# EAGLE schematic Sound_Activated_LED_Schematic (EAGLE 9.7.0)
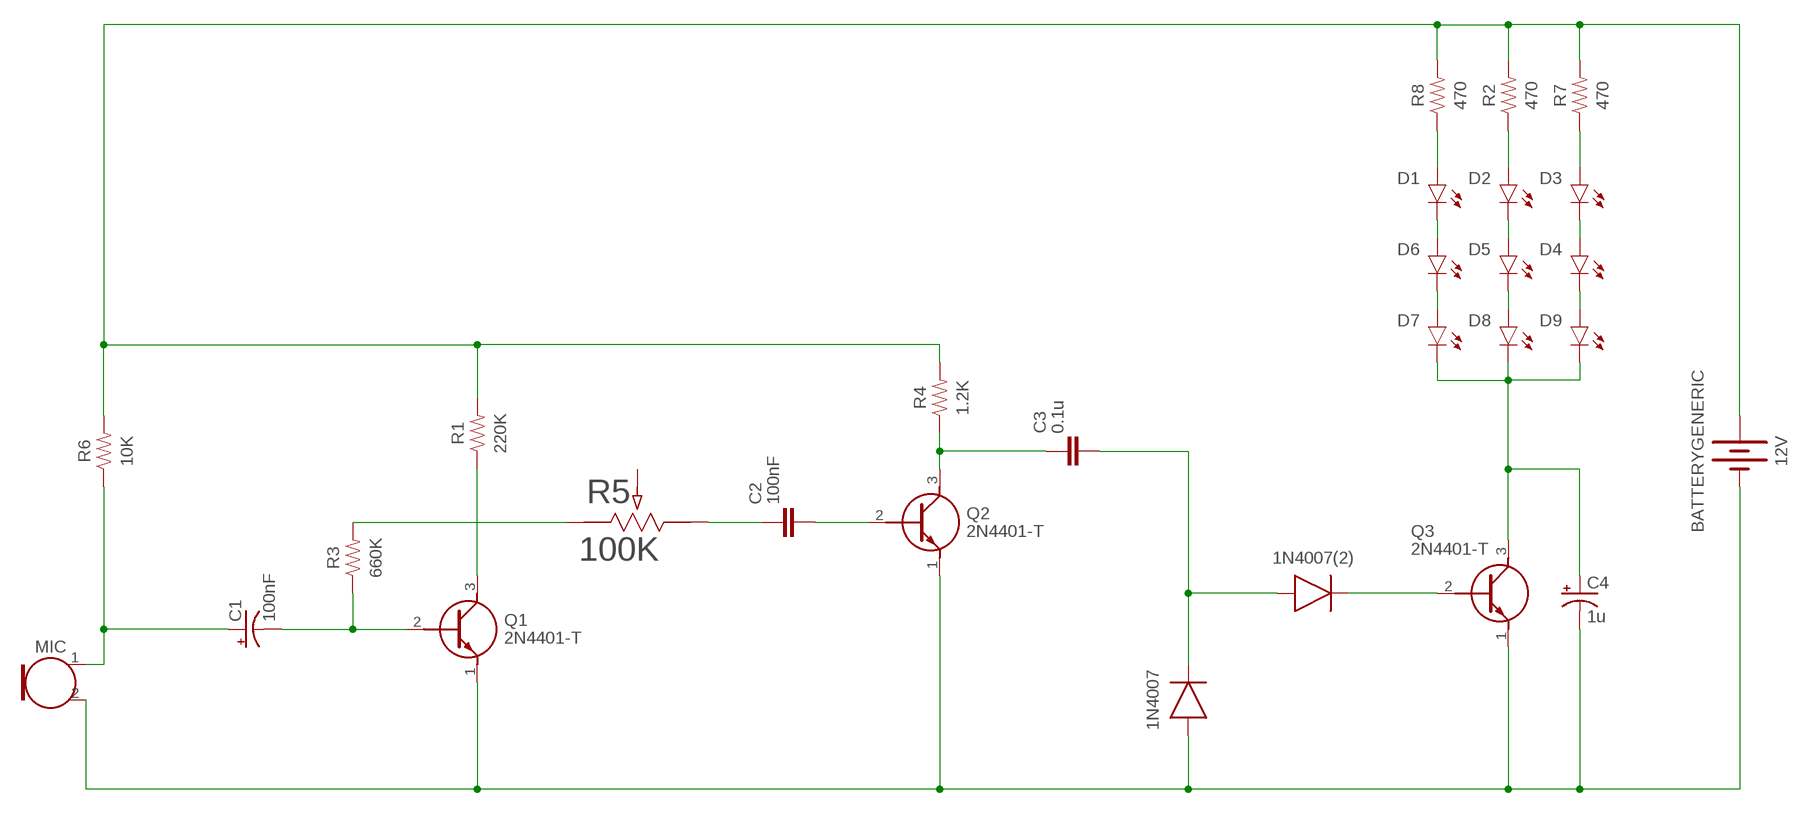
[diagram p0: schematic, sheet 1]

## Parts
1N4007  DIODE_1N4148W-7-F_SOD123G  [SOD3715X135]
1N4007(2)  DIODE_1N4148W-7-F_SOD123G  [SOD3715X135]
12V  BATTERYGENERIC  [BATTERY-GENERIC]
C1  100nF  C-POL-US_TANTALUM-1206(3216-METRIC)  [CAPMP3216X180N]
C2  100nF  C_CHIP-0402(1005-METRIC)  [CAPC1005X60]
C3  0.1u  C_CHIP-0402(1005-METRIC)  [CAPC1005X60]
C4  1u  C-POL-US_TANTALUM-1206(3216-METRIC)  [CAPMP3216X180N]
D1  CHIP-ROUND-R_0603  [LEDC1608X65N_RND-R]
D2  CHIP-ROUND-R_0603  [LEDC1608X65N_RND-R]
D3  CHIP-ROUND-R_0603  [LEDC1608X65N_RND-R]
D4  CHIP-ROUND-R_0603  [LEDC1608X65N_RND-R]
D5  CHIP-ROUND-R_0603  [LEDC1608X65N_RND-R]
D6  CHIP-ROUND-R_0603  [LEDC1608X65N_RND-R]
D7  CHIP-ROUND-R_0603  [LEDC1608X65N_RND-R]
D8  CHIP-ROUND-R_0603  [LEDC1608X65N_RND-R]
D9  CHIP-ROUND-R_0603  [LEDC1608X65N_RND-R]
MIC  CMA-4544PF-W  [CMA-4544PF-W]
Q1  2N4401-T  [2N4401T]
Q2  2N4401-T  [2N4401T]
Q3  2N4401-T  [2N4401T]
R1  220K  R-US_CHIP-0402(1005-METRIC)  [RESC1005X40]
R2  470  R-US_CHIP-0402(1005-METRIC)  [RESC1005X40]
R3  660K  R-US_CHIP-0402(1005-METRIC)  [RESC1005X40]
R4  1.2K  R-US_CHIP-0402(1005-METRIC)  [RESC1005X40]
R5  100K  1623760-2  [POT_1623757-2]
R6  10K  R-US_CHIP-0402(1005-METRIC)  [RESC1005X40]
R7  470  R-US_CHIP-0402(1005-METRIC)  [RESC1005X40]
R8  470  R-US_CHIP-0402(1005-METRIC)  [RESC1005X40]

## Nets
N$1: C1.1(+) MIC.1(OUT) R6.1
N$2: D1.A R8.1
N$3: Q1.3(C) R1.1
N$4: 1N4007.2(A) 12V.- C4.2(-) MIC.2(GND) Q1.1(E) Q2.1(E) Q3.1(E)
N$5: C1.2(-) Q1.2(B) R3.1
N$6: R3.2 R5.1
N$7: C2.1 R5.3
N$8: C2.2 Q2.2(B)
N$9: C3.1 Q2.3(C) R4.1
N$10: 12V.+ R1.2 R2.2 R4.2 R6.2 R7.2 R8.2
N$11: D2.A R2.1
N$12: D3.A R7.1
N$13: D1.C D6.A
N$14: D2.C D5.A
N$15: D3.C D4.A
N$16: D6.C D7.A
N$17: D5.C D8.A
N$18: D4.C D9.A
N$19: C4.1(+) D7.C D8.C D9.C Q3.3(C)
N$20: 1N4007(2).2(A) 1N4007.1(C) C3.2
N$21: 1N4007(2).1(C) Q3.2(B)
Unconnected: R5.2

## Library data of the parts
1N4007 1N4007(2) = Diode:DIODE_: Diode Rectifier - Popular parts; CATEGORY: Diode; DATASHEET: https://www.diodes.com/datasheet/download/1N4148W.pdf; DESCRIPTION: Diode 100 V 300mA Surface Mount SOD-123; FORWARD_CURRENT: 150mA; FORWARD_VOLTAGE: 1.25V; MANUFACTURER: Diodes Incorporated; MPN: 1N4148W-7-F; OPERATING_TEMPERATURE: -55°C ~ 150°C; PACKAGE_SIZE: SOD-123; PACKAGE_TYPE: SMD; PART_STATUS: ACTIVE; REVERSE_VOLTAGE: 100V; ROHS: COMPLIANT; SERIES: 1N4148; SUBCATEGORY: Rectifiers; TYPE: Small Signal Switching Diodes; ZENER_VOLTAGE: NA
12V = Tinkercad:BATTERY
C1 C4 = Capacitor:C-POL-US: Capacitor Polarised - ANSI; CATEGORY: Capacitor; PACKAGE_SIZE: 1206; PACKAGE_TYPE: SMD; SUBCATEGORY: Tantalum Capacitors; TYPE: Polymer Capacitors
C2 C3 = Capacitor:C: Capacitor - Generic; CATEGORY: Capacitor; PACKAGE_SIZE: 0402; PACKAGE_TYPE: SMD; SUBCATEGORY: Ceramic Capacitors; TYPE: MLCC
D1-D9 = LED:CHIP-ROUND-R: Red LED - Generic; CATEGORY: LED; COLOR: Red; DESCRIPTION: Red LED Indication 0603 (1608 Metric); PACKAGE_SIZE: 0603; PACKAGE_TYPE: SMD; SUBCATEGORY: Chip LED; TYPE: Square with Domed Top
MIC = Audio-Devices:CMA-4544PF-W: 20 Hz ~ 20 kHz Analog Microphone Electret Condenser 3 V ~ 10 V Omnidirectional (-44dB ±2dB) PC Pins Datasheet <https://www.cuidevices.com/product/resource/cma-4544pf-w.pdf>; CATEGORY: Audio-Devices; DATASHEET: https://www.sameskydevices.com/product/resource/cma-4544pf-w.pdf; DESCRIPTION: 20 Hz ~ 20 kHz Analog Microphone Electret Condenser 3 V ~ 10 V Omnidirectional (-44dB ±2dB) PC Pins; MANUFACTURER: Same Sky; MPN: CMA-4544PF-W; OPERATING_TEMPERATURE: NA; PACKAGE_SIZE: NA; PACKAGE_TYPE: THT; PART_STATUS: ACTIVE; ROHS: COMPLIANT; SERIES: NA; SUBCATEGORY: Microphone; TYPE: Electret Condenser
Q1-Q3 = 2N4401-T:2N4401-T: Bipolar Transistors - BJT NPN 0.6A 40V Gen Pur Source: Datasheet <https://www.rectron.com/public/product_datasheets/2n4401.pdf>; DESCRIPTION: Bipolar Transistors - BJT NPN 0.6A 40V Gen Pur; HEIGHT: 4.6mm; MANUFACTURER_NAME: Rectron; MANUFACTURER_PART_NUMBER: 2N4401-T; MOUSER_PART_NUMBER: 583-2N4401-T; MOUSER_PRICE-STOCK: https://www.mouser.co.uk/ProductDetail/Rectron/2N4401-T?qs=FOlmdCx%252BAA2PuSUxt27Oyw%3D%3D
R1-R4 R6-R8 = Resistor:R-US: Resistor Fixed - ANSI; CATEGORY: Resistors; DESCRIPTION: Chip Resistor 1.05 X 0.54 X 0.40 mm body 0402(1005-METRIC) Package; PACKAGE_SIZE: 0402; PACKAGE_TYPE: SMD
R5 = Resistors:1623760-2; BUILT_BY: EMA_UL_Team; CATEGORY: Potentiometers; COPYRIGHT: Copyright (C) 2016 Accelerated Designs. All rights reserved; DESCRIPTION: 23E 10KA 6.35X50FL B7 CAT; MANUFACTURER_PART_NUMBER: 23ESA103MMF50NF; PART_STATUS: active; SERIES: Unknown; VENDOR: TE Connectivity